# Altium schematic sheet 7) EMAC.SchDoc
size 420 x 297 mm
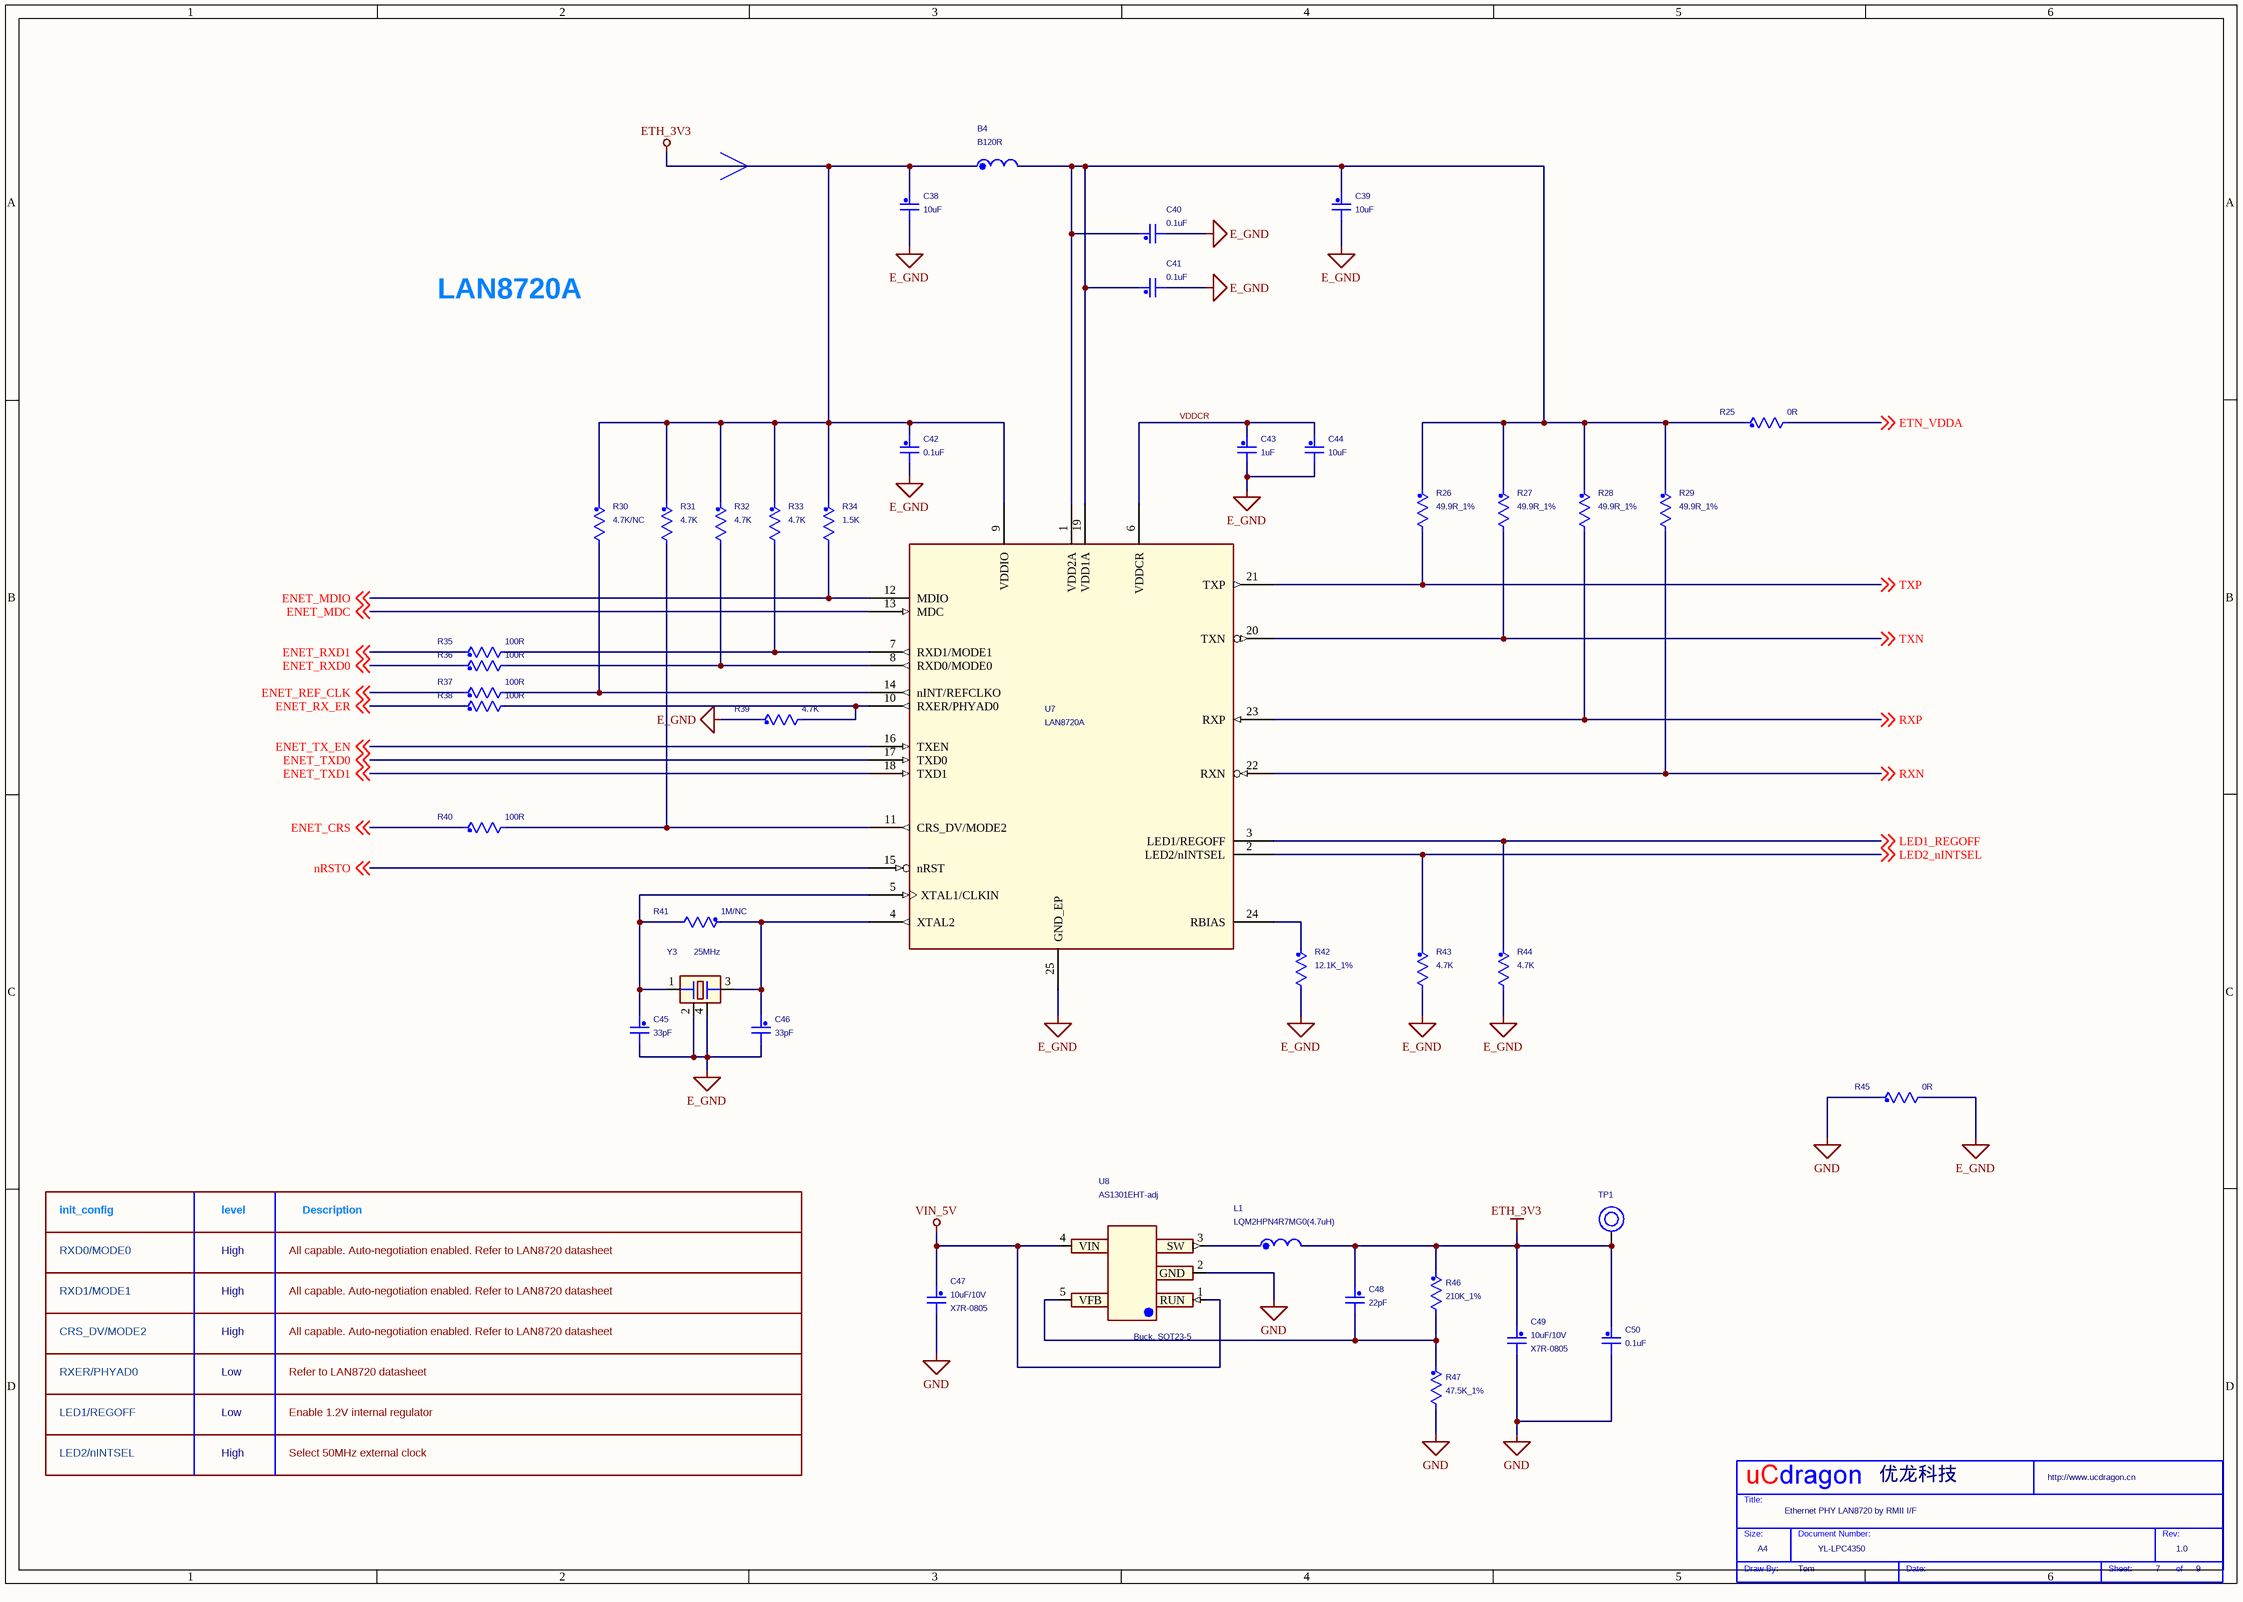
[diagram p0: 7) EMAC.SchDoc]

## Parts
*  Company: 优龙科技  Drawing: Tom  Doc: YL-LPC4350  RevCode: 1.0  Title: Ethernet PHY LAN8720 by RMII I/F  Page Size: A4  Page Number: 7  Page Count: 9  (hidden comment: My Title 0)  (graphical)
B4  B120R  [R0603]
C38  10uF  [CAP0805]
C39  10uF  [CAP0805]
C40  0.1uF  [CAP0805]
C41  0.1uF  [CAP0805]
C42  0.1uF  [CAP0805]
C43  1uF  [CAP0805]
C44  10uF  [CAP0805]
C45  33pF  [CAP0805]
C46  33pF  [CAP0805]
C47  10uF/10V  Note: X7R-0805  [CAP0805]
C48  22pF  [CAP0805]
C49  10uF/10V  Note: X7R-0805  [CAP0805]
C50  0.1uF  [CAP0805]
L1  LQM2HPN4R7MG0(4.7uH)  [L2.5X1.5]
R25  0R  [R0603]
R26  49.9R_1%  [R0603]
R27  49.9R_1%  [R0603]
R28  49.9R_1%  [R0603]
R29  49.9R_1%  [R0603]
R30  4.7K/NC  [R0603]
R31  4.7K  [R0603]
R32  4.7K  [R0603]
R33  4.7K  [R0603]
R34  1.5K  [R0603]
R35  100R  [R0603]
R36  100R  [R0603]
R37  100R  [R0603]
R38  100R  [R0603]
R39  4.7K  [R0603]
R40  100R  [R0603]
R41  1M/NC  [R0603]
R42  12.1K_1%  [R0603]
R43  4.7K  [R0603]
R44  4.7K  [R0603]
R45  0R  [R0805]
R46  210K_1%  [R0402]
R47  47.5K_1%  [R0402]
TP1  3.3V  [XP-TP-H0.8MM]  (value not drawn)
U7  LAN8720A  [QFN24_4X4MM_EP2P5MM]
U8  AS1301EHT-adj  Note: Buck, SOT23-5  [SOT23-5]
Y3  25MHz  [XTAL3.2X2.5]

## Nets
E_GND: C38.2 C39.2 C40.2 C41.2 C42.2 C43.2 C44.2 C45.2 C46.2 R39.1 R42.2 R43.2 R44.2 R45.2 U7.25(GND_EP) Y3.2(NC) Y3.4(NC)
ETH_3V3: B4.1 C38.1 C42.1 C48.1 C49.1 C50.1 L1.2 R30.1 R31.1 R32.1 R33.1 R34.1 R46.1 TP1.1 U7.9(VDDIO)
GND: C47.2 C49.2 C50.2 R45.1 R47.2 U8.2(GND)
VIN_5V: C47.1 U8.1(RUN) U8.4(VIN)
ENET_CRS: R40.1 ; off-sheet ENET_CRS
ENET_MDC: U7.13(MDC) ; off-sheet ENET_MDC
ENET_MDIO: R34.2 U7.12(MDIO) ; off-sheet ENET_MDIO
ENET_REF_CLK: R37.1 ; off-sheet ENET_REF_CLK
ENET_RX_ER: R38.1 ; off-sheet ENET_RX_ER
ENET_RXD0: R36.1 ; off-sheet ENET_RXD0
ENET_RXD1: R35.1 ; off-sheet ENET_RXD1
ENET_TX_EN: U7.16(TXEN) ; off-sheet ENET_TX_EN
ENET_TXD0: U7.17(TXD0) ; off-sheet ENET_TXD0
ENET_TXD1: U7.18(TXD1) ; off-sheet ENET_TXD1
ETN_VDDA: R25.2 ; off-sheet ETN_VDDA
LED1_REGOFF: R44.1 U7.3(LED1/REGOFF) ; off-sheet LED1_REGOFF
LED2_nINTSEL: R43.1 U7.2(LED2/nINTSEL) ; off-sheet LED2_nINTSEL
nRSTO: U7.15(nRST) ; off-sheet nRSTO
RXN: R29.2 U7.22(RXN) ; off-sheet RXN
RXP: R28.2 U7.23(RXP) ; off-sheet RXP
TXN: R27.2 U7.20(TXN) ; off-sheet TXN
TXP: R26.2 U7.21(TXP) ; off-sheet TXP
VDDCR: C43.1 C44.1 U7.6(VDDCR)
NetB4_2: B4.2 C39.1 C40.1 C41.1 R25.1 R26.1 R27.1 R28.1 R29.1 U7.1(VDD2A) U7.19(VDD1A)
NetC45_1: C45.1 R41.2 U7.5(XTAL1/CLKIN) Y3.1
NetC46_1: C46.1 R41.1 U7.4(XTAL2) Y3.3
NetC48_2: C48.2 R46.2 R47.1 U8.5(VFB)
NetL1_1: L1.1 U8.3(SW)
NetR30_2: R30.2 R37.2 U7.14(nINT/REFCLKO)
NetR31_2: R31.2 R40.2 U7.11(CRS_DV/MODE2)
NetR32_2: R32.2 R36.2 U7.8(RXD0/MODE0)
NetR33_2: R33.2 R35.2 U7.7(RXD1/MODE1)
NetR38_2: R38.2 R39.2 U7.10(RXER/PHYAD0)
NetR42_1: R42.1 U7.24(RBIAS)

## Notes on the sheet
- LAN8720A
- RXD0/MODE0
- init_config
- level
- High
- All capable. Auto-negotiation enabled. Refer to LAN8720 datasheet
- Description
- CRS_DV/MODE2
- RXD1/MODE1
- RXER/PHYAD0
- Low
- Refer to LAN8720 datasheet
- LED1/REGOFF
- LED2/nINTSEL
- Select 50MHz external clock
- Enable 1.2V internal regulator
- (in symbol My Title 0) Title:; Size:; Document Number:; Rev:; Draw By:; Date:; Sheet:; of

## Library data of the parts
B4 L1 = Inductor PWR-SMD
C38-C46 C48 C50 = C_Generic: Toler.: 10%; P/N #1: C0603C104K4RAC; Voltage: 16V; Mfg #1: KEMET; Dielectric: X7R
C47 C49 = C_Generic: Toler.: 10%; P/N #1: C0603C104K4RAC; Voltage: 16V; Mfg #1: KEMET; Dielectric: X7R; 封装: 0805; 类型: 贴片陶瓷电容
R25-R45 = R_Generic_Dup2
R46 R47 = R_Generic: P/N #3: CR10-103J-T; Toler.: 1%; Watts: 0.1W; P/N #1: RK73H1JT1002F; Mfg #1: KOA SPEER; Mfg #3: AVX
TP1 = TestPoint-HOLE
U7 = LAN8720 QFN24: PART#: SMSC LAN8720A-CP
U8 = RT8008-PB
Y3 = DSX321G_0
* = My Title 0: WebSite: http://www.ucdragon.cn; Page Create Date: May 29, 2006